# EAGLE design rc_switch_dualsided_with_fet_driver (EAGLE 6.5.0)
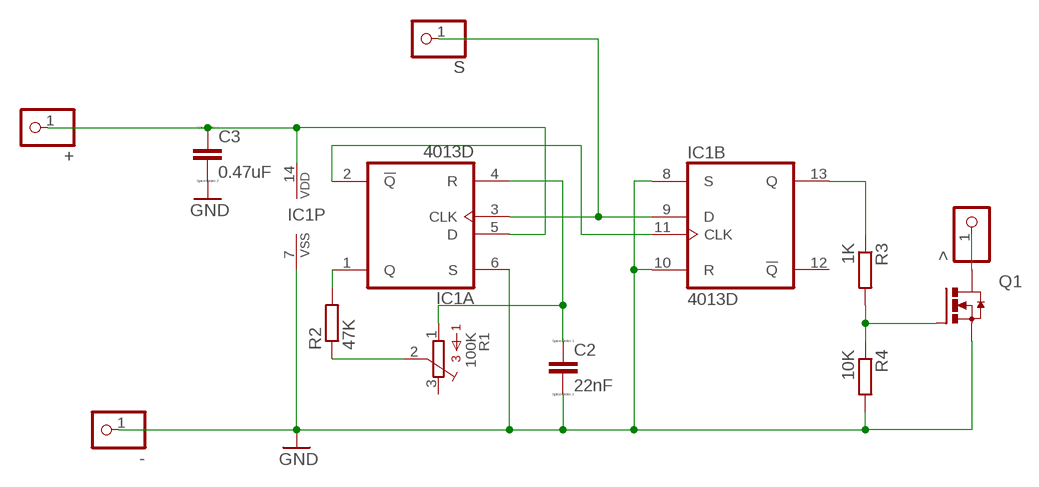
[diagram p0: schematic, sheet 1]

## Parts
+  PINHD-1X1  [1X01]
-  PINHD-1X1  [1X01]
>  PINHD-1X1  [1X01]
C2  22nF  CC3216  [C3216]
C3  0.47uF  CC3216  [C3216]
IC1  4013D  [SO14]
Q1  IRF3704S  [D2PACK]
R1  100K  3386-P  [3386P]
R2  47K  R-EU_R3225  [R3225]
R3  1K  R-EU_R3225  [R3225]
R4  10K  R-EU_R3225  [R3225]
S  PINHD-1X1  [1X01]

## Nets
GND: -.1 C2.2 C3.2 IC1.6(A:S) IC1.7(P:VSS) IC1.8(B:S) IC1.10(B:R) Q1.3(S) R4.2
N$1: IC1.1(A:Q) R2.2
N$2: R1.2 R2.1
N$3: C2.1 IC1.4(A:R) R1.1
N$4: IC1.13(B:Q) R3.1
N$6: IC1.3(A:CLK) IC1.9(B:D) S.1
N$7: >.1 Q1.2(D)
N$8: IC1.2(A:!Q) IC1.11(B:CLK)
N$9: +.1 C3.1 IC1.5(A:D) IC1.14(P:VDD)
OUTPUT: Q1.1(G) R3.2 R4.1
Unconnected: IC1.12(B:!Q) R1.3

## Library data of the parts
+ - > S = pinhead:PINHD-1X1: PIN HEADER
C2 C3 = eagle-ltspice:C: CAPACITOR, European symbol; SPICEMODEL: NONE; SPICEPREFIX: C
IC1 = 40xx:4013: Dual D FLIP FLOP, set/reset
Q1 = transistor-power:IRF3704: SMPS MOSFET HEXFET® Power MOSFET Source: http://www.irf.com/product-info/datasheets/data/irf3704.pdf
R1 = bourns:3386-: 3386 Series 3/8" Square Trimmer
R2-R4 = rcl:R-EU_: RESISTOR, European symbol

## Board
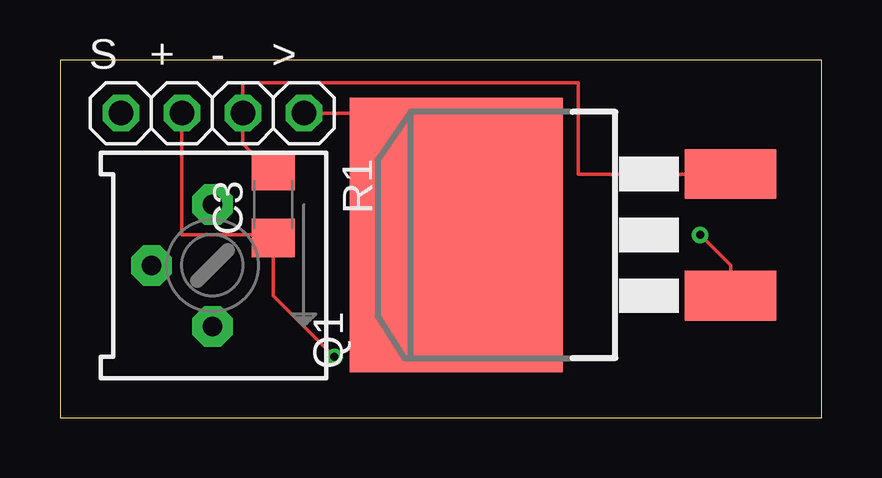
[diagram p1: board, top side]
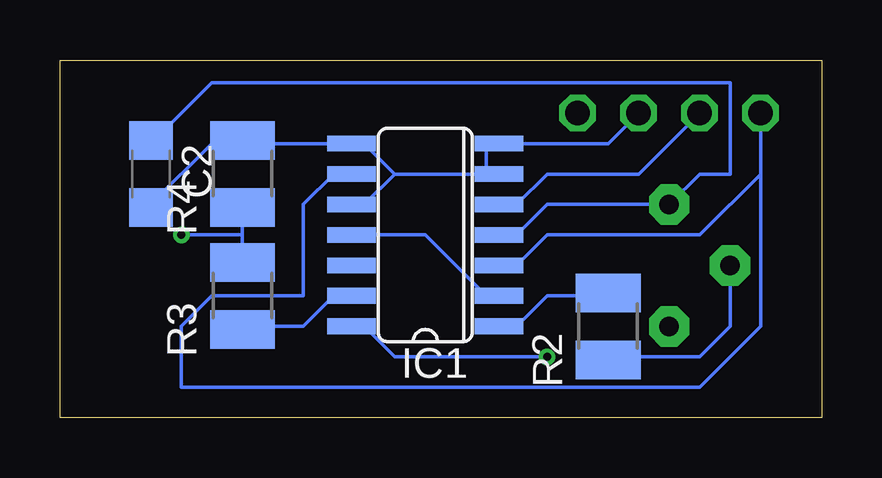
[diagram p2: board, bottom side, seen from below]

Size 31.73 x 14.91 mm. Coordinates in mm from the lower left corner, seen from the top.
Outline: 0,0 31.73,0 31.73,14.91 0,14.91 0,0
Copper layers (1*16): Top 0.0356mm / dielectric 1.5011mm / Bottom 0.0356mm
Design rules "LaenPCBOrder": minimum track width 6mil, minimum drill 13mil, track to track 6mil, track to pad 6mil, pad to pad 6mil, via to via 6mil, smd to smd 6mil, copper to edge 15mil, drill to drill 6mil, minimum pad ring 7mil, minimum via ring 7mil, stop-mask expansion 3mil, vias tented up to drill 0mil, thermal gap 10mil

### Footprints (pad centres in the part's own frame; a part is rotated, then mirrored left to right if it is on the bottom)
1X01 = drill 1.016 octagon: 1 0,0
C3216 = smd 1.6 x 1.8: 1 -1.4,0; 2 1.4,0
SO14 = smd 0.66 x 2.032: 1 -3.81,-3.073; 2 -2.54,-3.073; 3 -1.27,-3.073; 4 0,-3.073; 5 1.27,-3.073; 6 2.54,-3.073; 7 3.81,-3.073; 8 3.81,3.073; 9 2.54,3.073; 10 1.27,3.073; 11 0,3.073; 12 -1.27,3.073; 13 -2.54,3.073; 14 -3.81,3.073
D2PACK = smd 2.083 x 3.81: 1 -2.54,-8.89; 3 2.54,-8.89 | smd 11.43 x 8.89: 2 0,2.54
3386P = drill 0.813 pad 1.676 octagon: 1 -2.54,0; 2 0,-2.54; 3 2.54,0
R3225 = smd 1.6 x 2.7: 1 -1.4,0; 2 1.4,0

### Placement (x,y rotation side)
+  5.08,12.7 0 top
-  7.62,12.7 0 top
>  10.16,12.7 0 top
C2  27.94,10.16 270 bottom
C3  8.89,8.89 90 top
IC1  16.51,7.62 90 bottom
Q1  19.05,7.62 90 top
R1  6.35,6.35 270 top
R2  8.89,3.81 90 bottom
R3  24.13,5.08 90 bottom
R4  24.13,10.16 90 bottom
S  2.54,12.7 0 top

### Tracks (layer width: path | path; a pad name or v marks a point on that pad's centre or on a via)
GND
  Top 0.152: C3.2 8.89,10.16 7.62,11.43 -.1 7.62,13.97 21.59,13.97 21.59,10.16 Q1.3
  Bottom 0.152: 24.13,11.43 25.4,11.43 27.94,8.89 C2.2 | 13.97,10.16 13.97,11.43 IC1.7 8.89,11.43 -.1 | 17.78,10.16 19.05,8.89 IC1.10 | 13.97,10.16 17.78,10.16 | 13.97,10.16 IC1.6 | 17.78,10.16 19.05,11.43 IC1.8 24.13,11.43 | 24.13,11.43 R4.2
N$1
  Bottom 0.152: IC1.1 12.7,3.81 11.43,5.08 8.89,5.08 R2.2
N$2
  Bottom 0.152: R1.2 3.81,3.81 5.08,2.54 8.89,2.54 R2.1
N$3
  Bottom 0.152: C2.1 27.94,11.43 25.4,13.97 3.81,13.97 3.81,10.16 5.08,10.16 R1.1 11.43,8.89 12.7,7.62 IC1.4
N$4
  Bottom 0.152: IC1.13 20.32,5.08 21.59,3.81 24.13,3.81 R3.1
N$6
  Bottom 0.152: 2.54,10.16 5.08,7.62 11.43,7.62 12.7,6.35 IC1.3 | S.1 2.54,10.16 | 2.54,10.16 2.54,3.81 5.08,1.27 26.67,1.27 26.67,3.81 25.4,5.08 21.59,5.08 21.59,8.89 20.32,10.16 IC1.9
N$7
  Top 0.152: >.1 16.51,12.7 Q1.2
N$8
  Bottom 0.152: IC1.11 16.51,7.62 13.97,5.08 IC1.2
N$9  (via drill 0.33)
  Top 0.152: +.1 5.08,7.62 8.89,7.62 C3.1 8.89,5.08 v11.43,2.54
  Bottom 0.152: +.1 7.62,10.16 11.43,10.16 12.7,8.89 IC1.5 | v11.43,2.54 17.78,2.54 19.05,3.81 IC1.14
OUTPUT  (via drill 0.33)
  Top 0.152: v26.67,7.62 27.94,6.35 Q1.1
  Bottom 0.152: 24.13,7.62 R4.1 24.13,8.89 | 24.13,7.62 R3.2 24.13,6.35 | v26.67,7.62 24.13,7.62